# EAGLE schematic ultrasonic (EAGLE 4.15)
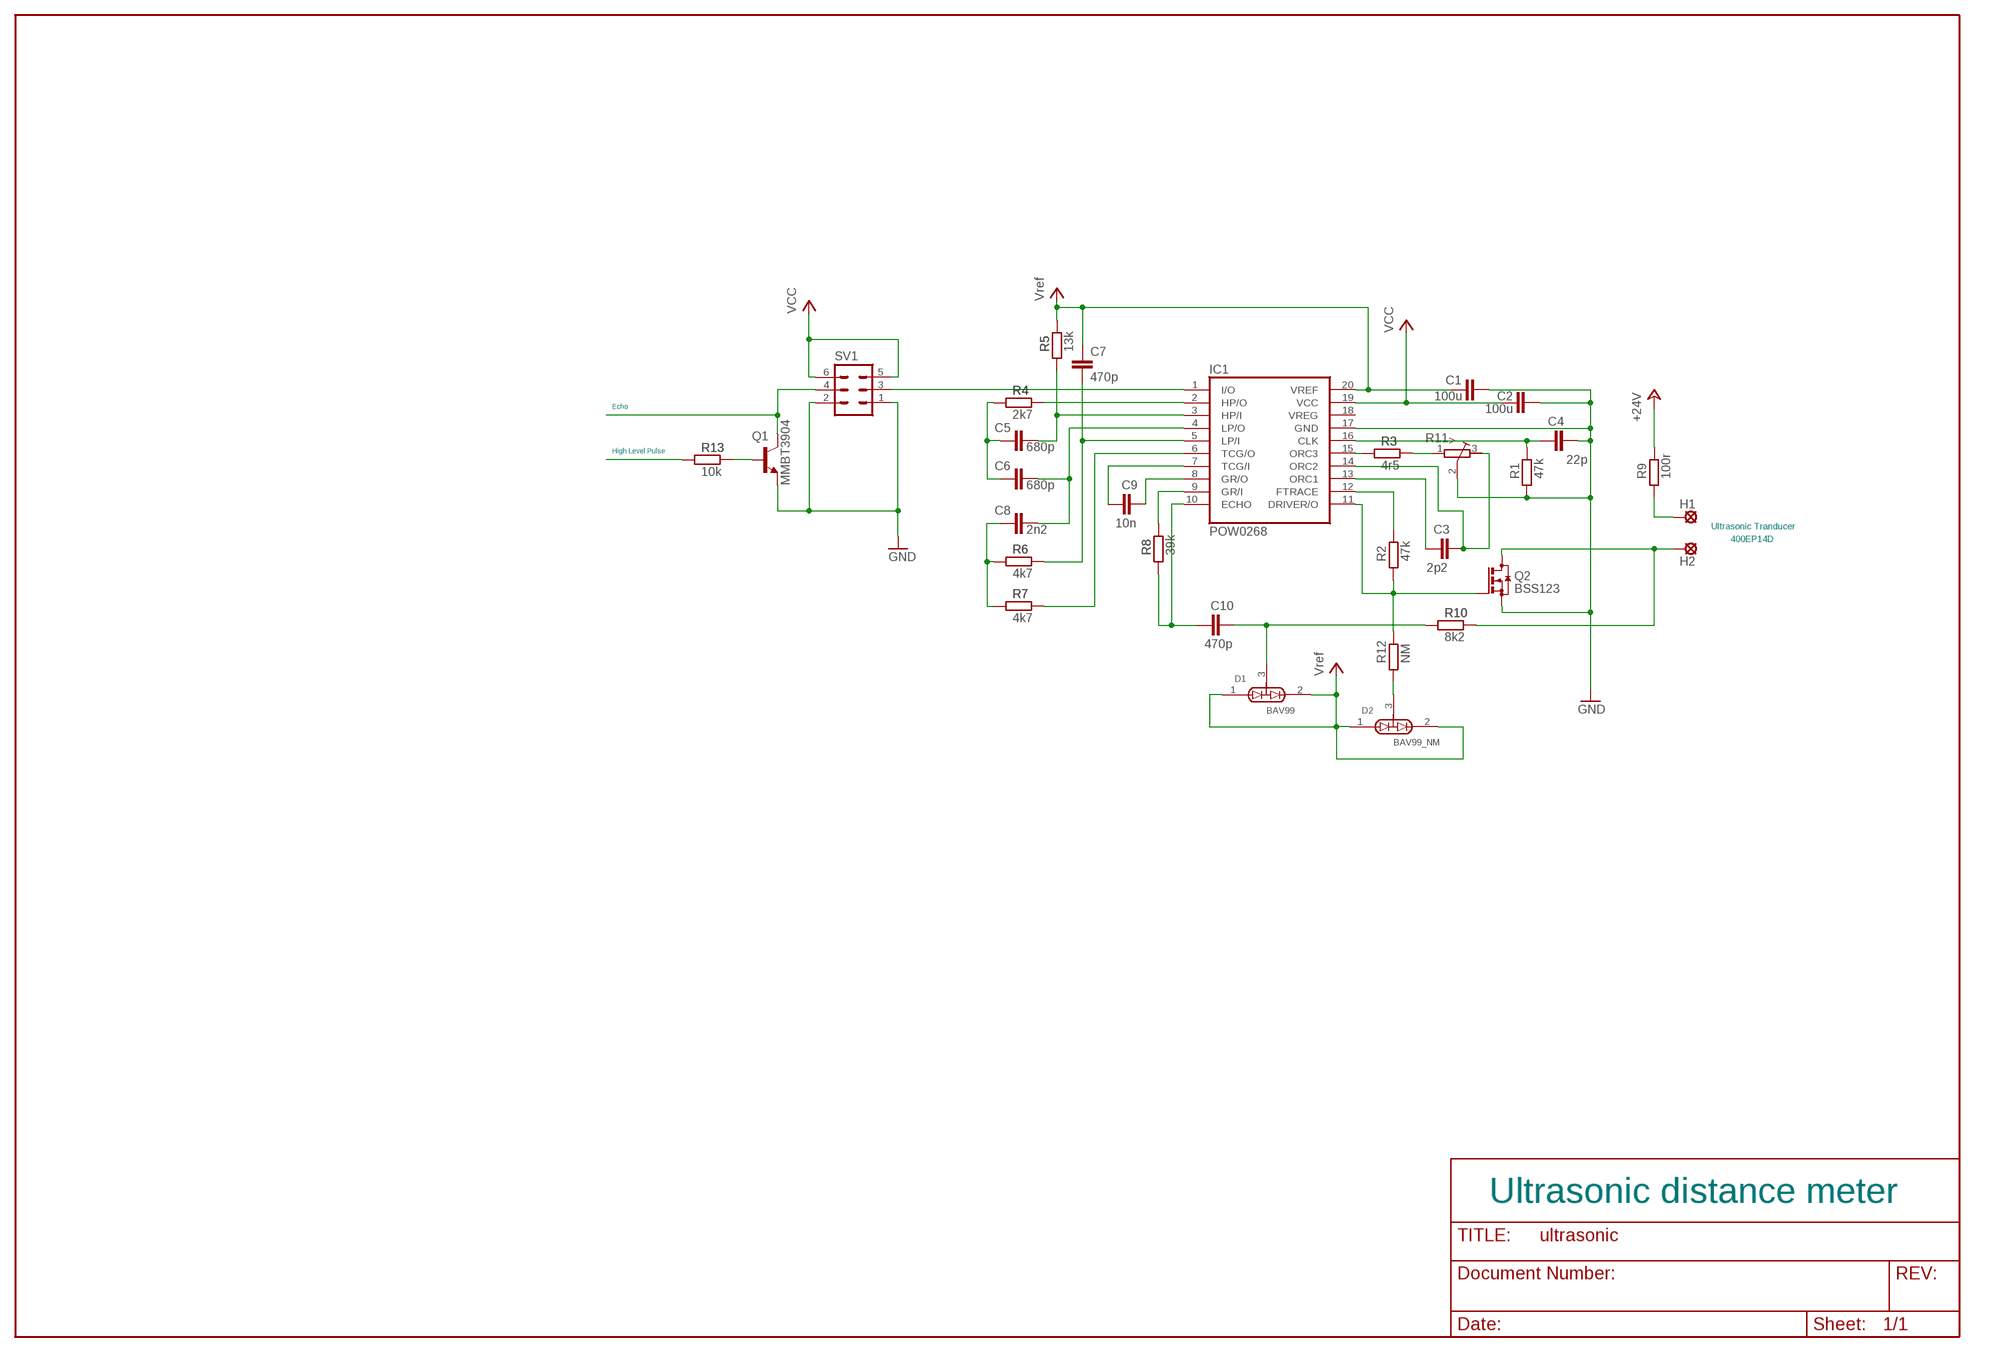
[diagram p0: schematic, sheet 1]

## Parts
C1  100u  C-EUC0805K  [C0805K]
C2  100u  C-EUC0805K  [C0805K]
C3  2p2  C-EUC0805K  [C0805K]
C4  22p  C-EUC0805K  [C0805K]
C5  680p  C-EUC0805K  [C0805K]
C6  680p  C-EUC0805K  [C0805K]
C7  470p  C-EUC0805K  [C0805K]
C8  2n2  C-EUC0805K  [C0805K]
C9  10n  C-EUC0805K  [C0805K]
C10  470p  C-EUC0805K  [C0805K]
D1  BAV99  [SOT23]
D2  BAV99_NM  BAV99  [SOT23]
H1  LSP10  [LSP10]
H2  LSP10  [LSP10]
IC1  POW0268  [SSOP20BU]
Q1  MMBT3904  MMBT3904LT1-NPN-SOT23-BEC  [SOT23-BEC]
Q2  BSS123  [SOT23]
R1  47k  R-EU_R0805W  [R0805W]
R2  47k  R-EU_R0805W  [R0805W]
R3  4r5  R-EU_R0805W  [R0805W]
R4  2k7  R-EU_R0805W  [R0805W]
R5  13k  R-EU_R0805W  [R0805W]
R6  4k7  R-EU_R0805W  [R0805W]
R7  4k7  R-EU_R0805W  [R0805W]
R8  39k  R-EU_R0805W  [R0805W]
R9  100r  R-EU_R0805W  [R0805W]
R10  8k2  R-EU_R0805W  [R0805W]
R11  R-TRIMM64W  [RTRIM64W]
R12  NM  R-EU_R0805W  [R0805W]
R13  10k  R-EU_R0805W  [R0805W]
SV1  MA03-2  [MA03-2]

## Nets
0V: Q1.E SV1.1 SV1.2 ; supply symbol labelled GND
+24V: R9.2
GND: C1.2 C2.2 C4.1 IC1.17(GND) Q2.2(S) R1.1 R11.2(S)
N$1: IC1.15(ORC3) R3.1
N$2: R3.2 R11.1(E)
N$3: C3.2 IC1.13(ORC1)
N$4: C4.2 IC1.16(CLK) R1.2
N$5: IC1.12(FTRACE) R2.2
N$6: D2.3 R12.1
N$7: IC1.11(DRIVER/O) Q2.1(G) R2.1 R12.2
N$8: H2.MP Q2.3(D) R10.2
N$9: IC1.1(I/O) SV1.3
N$10: IC1.2(HP/O) R4.2
N$11: C5.1 IC1.3(HP/I) R5.1
N$12: C7.1 IC1.5(LP/I) R6.2
N$13: C9.2 IC1.7(TCG/I)
N$14: C6.1 C8.1 IC1.4(LP/O)
N$15: C8.2 R6.1 R7.1
N$16: C5.2 C6.2 R4.1
N$17: IC1.6(TCG/O) R7.2
N$18: C9.1 IC1.8(GR/O)
N$19: IC1.9(GR/I) R8.2
N$20: C10.2 IC1.10(ECHO) R8.1
N$21: H1.MP R9.1
N$22: C10.1 D1.3 R10.1
N$23: C3.1 IC1.14(ORC2) R11.3(A)
N$24: Q1.B R13.2
N$25: R13.1
N$26: Q1.C SV1.4
VCC: C1.1 C2.1 C7.2 D1.1 D1.2 D2.1 D2.2 IC1.19(VCC) IC1.20(VREF) R5.2 SV1.5 SV1.6 ; supply symbol labelled Vref
Unconnected: IC1.18(VREG)

## Notes on the sheet
- Echo
- High Level Pulse
- Ultrasonic Tranducer
- 400EP14D
- Ultrasonic distance meter

## Library data of the parts
C1-C10 = rcl:C-EU: CAPACITOR, European symbol
D1 D2 = lbm:BAV99
H1 H2 = solpad:LSP10: SOLDER PAD drill 1.0 mm, distributor Buerklin, 12H555
IC1 = lbm:POW0268
Q1 = transistor:*-NPN-: NPN Transistror
Q2 = transistor-small-signal:BSS123: N-CHANNEL MOS FET
R1-R10 R12 R13 = rcl:R-EU_: RESISTOR, European symbol
R11 = rcl:R-TRIMM: Trimm resistor
SV1 = con-lstb:MA03-2: PIN HEADER

## Net classes
1 power: width 0.813 mm, drill 0.203 mm